# EAGLE schematic Arm Board V4 (EAGLE 7.1.0)

## Sheet 1 of 5: Power
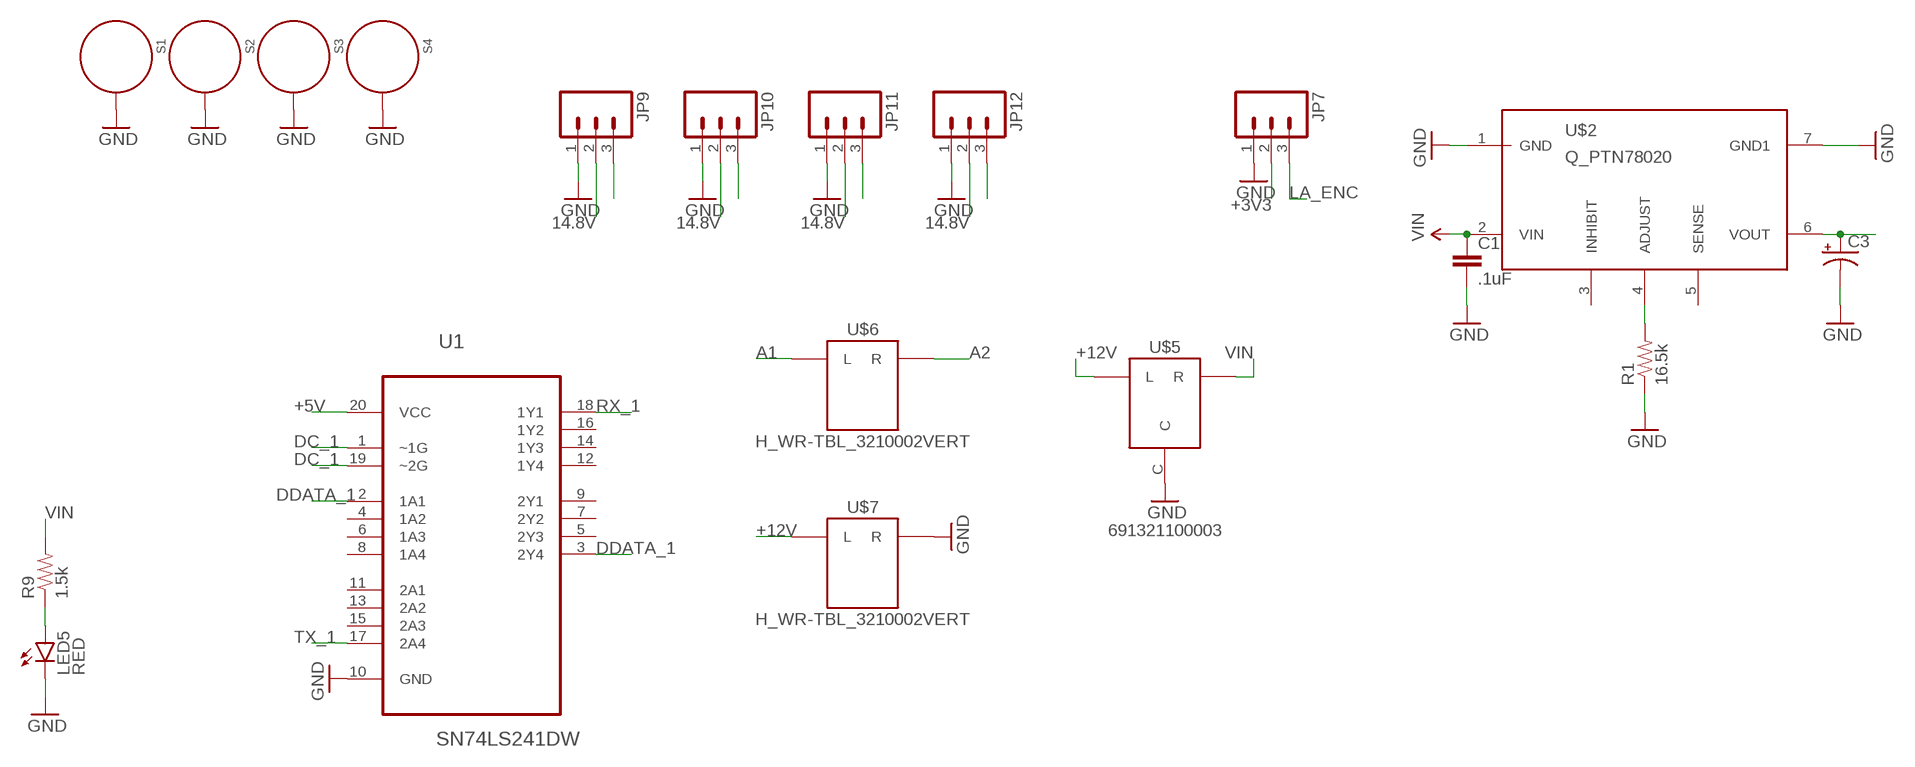
[diagram p0: schematic, sheet 1]

### Parts
C1  .1uF  CAP1206  [1206]
C3  CAP_POLC  [PANASONIC_C]
JP7  M03PTH  [1X03]
JP9  M03PTH  [1X03]
JP10  M03PTH  [1X03]
JP11  M03PTH  [1X03]
JP12  M03PTH  [1X03]
LED5  RED  LED-RED0603  [LED-0603]
R1  16.5k  RESISTOR1206  [1206]
R9  1.5k  RESISTOR1206  [1206]
S1  STANDOFF_ELECTRICAL  [STANDOFF-ELECTRICAL]
S2  STANDOFF_ELECTRICAL  [STANDOFF-ELECTRICAL]
S3  STANDOFF_ELECTRICAL  [STANDOFF-ELECTRICAL]
S4  STANDOFF_ELECTRICAL  [STANDOFF-ELECTRICAL]
U1  SN74LS241DW  [SOIC127P1030X265-20N]
U$2  Q_PTN78020  [R_PDSS-T7]
U$5  691321100003  [691322110003]
U$6  H_WR-TBL_3210002VERT  [691321100002]
U$7  H_WR-TBL_3210002VERT  [691321100002]

### Nets
14.8V: C3.+ JP9.2 JP10.2 JP11.2 JP12.2 U$2.6(VOUT)
+3V3: JP7.2 ; also sheet 2,3,4
+5V: U1.20(VCC) ; also sheet 2
+12V: U$5.L U$7.L ; also sheet 5
A1: U$6.L ; also sheet 5
A2: U$6.R ; also sheet 5
DC_1: U1.1(~1G) U1.19(~2G) ; also sheet 2
DDATA_1: JP9.3 JP10.3 JP11.3 JP12.3 U1.2(1A1) U1.3(2Y4)
GND: C1.2 C3.- JP7.1 JP9.1 JP10.1 JP11.1 JP12.1 LED5.C R1.1 S1.P1 S2.P1 S3.P1 S4.P1 U1.10(GND) U$2.1(GND) U$2.7(GND1) U$5.C U$7.R ; also sheet 2,3,4,5
LA_ENC: JP7.3 ; also sheet 2
N$9: R1.2 U$2.4(ADJUST)
N$14: LED5.A R9.1
RX_1: U1.18(1Y1) ; also sheet 2
TX_1: U1.17(2A4) ; also sheet 2
VIN: C1.1 R9.2 U$2.2(VIN) U$5.R
Unconnected: U1.4(1A2) U1.5(2Y3) U1.6(1A3) U1.7(2Y2) U1.8(1A4) U1.9(2Y1) U1.11(2A1) U1.12(1Y4) U1.13(2A2) U1.14(1Y3) U1.15(2A3) U1.16(1Y2) U$2.3(INHIBIT) U$2.5(SENSE)

## Sheet 2 of 5: Processor
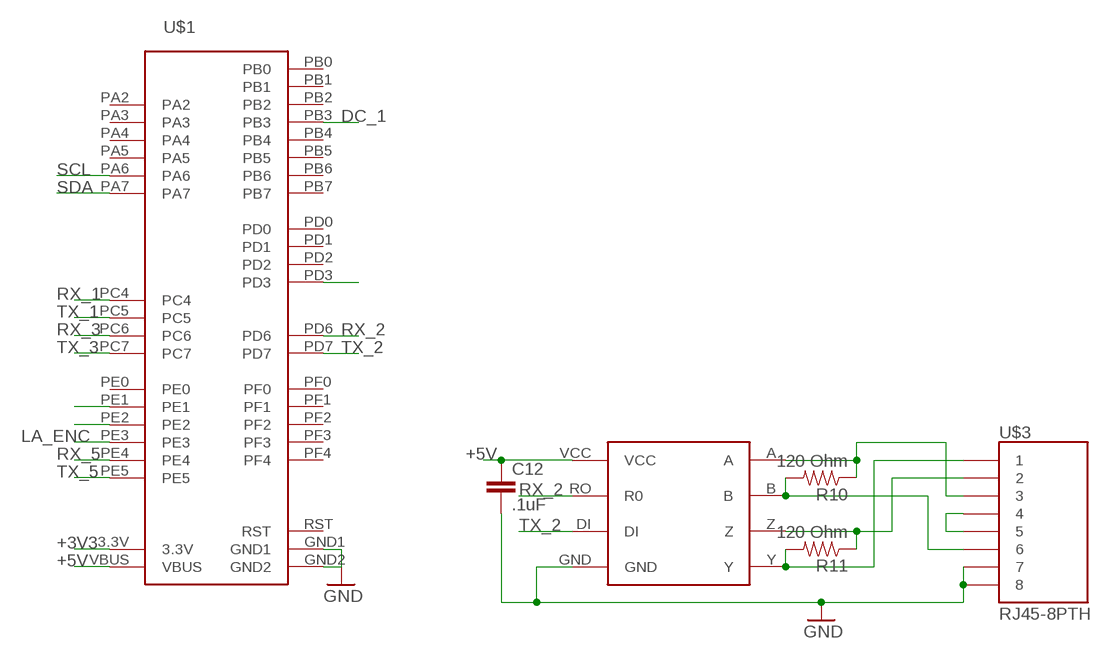
[diagram p1: schematic, sheet 2]

### Parts
C12  .1uF  CAP1206  [1206]
R10  120 Ohm  RESISTOR1206  [1206]
R11  120 Ohm  RESISTOR1206  [1206]
U$1  STELLARIS-LAUNCHPADSTELLARIS-LAUNCHPAD-XL  [LAUNCHPAD-XL]
U$3  RJ45-8PTH  [RJ45-8]
U$4  MAX3077  [MAX3070E]

### Nets
+3V3: U$1.3.3V ; also sheet 1,3,4
+5V: C12.1 U$1.VBUS U$3.4 U$3.5 U$4.VCC ; also sheet 1
DC_1: U$1.PB3 ; also sheet 1
EN_A: U$1.PD3 ; also sheet 5
GND: C12.2 U$1.GND1 U$1.GND2 U$3.7 U$3.8 U$4.GND ; also sheet 1,3,4,5
IN1_A: U$1.PE1 ; also sheet 5
IN2_A: U$1.PE2 ; also sheet 5
LA_ENC: U$1.PE3 ; also sheet 1
N$1: R11.1 U$3.2 U$4.Z
N$2: R10.2 U$3.6 U$4.B
N$3: R10.1 U$3.3 U$4.A
N$5: R11.2 U$3.1 U$4.Y
RX_1: U$1.PC4 ; also sheet 1
RX_2: U$1.PD6 U$4.RO(R0)
RX_3: U$1.PC6 ; also sheet 3
RX_5: U$1.PE4
SCL: U$1.PA6 ; also sheet 4
SDA: U$1.PA7 ; also sheet 4
TX_1: U$1.PC5 ; also sheet 1
TX_2: U$1.PD7 U$4.DI
TX_3: U$1.PC7 ; also sheet 3
TX_5: U$1.PE5
Unconnected: U$1.PA2 U$1.PA3 U$1.PA4 U$1.PA5 U$1.PB0 U$1.PB1 U$1.PB2 U$1.PB4 U$1.PB5 U$1.PB6 U$1.PB7 U$1.PD0 U$1.PD1 U$1.PD2 U$1.PE0 U$1.PF0 U$1.PF1 U$1.PF2 U$1.PF3 U$1.PF4

## Sheet 3 of 5: Xbee
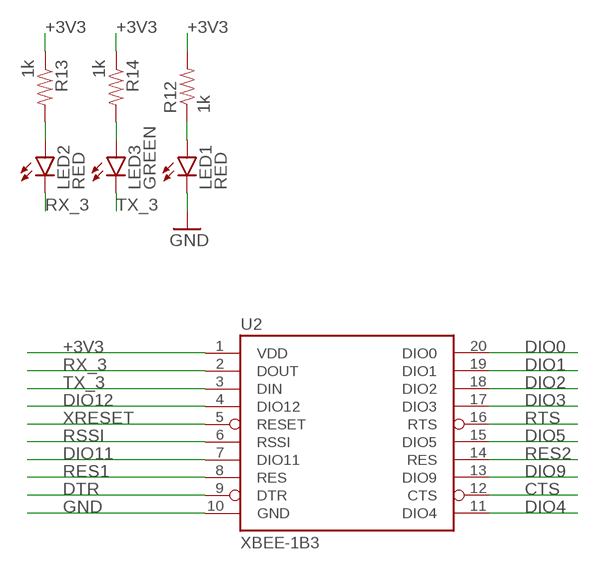
[diagram p2: schematic, sheet 3]

### Parts
LED1  RED  LED-RED0603  [LED-0603]
LED2  RED  LED-RED0603  [LED-0603]
LED3  GREEN  LED-GREEN0603  [LED-0603]
R12  1k  RESISTOR1206  [1206]
R13  1k  RESISTOR1206  [1206]
R14  1k  RESISTOR1206  [1206]
U2  XBEE-1B3  [XBEE-SMD]

### Nets
+3V3: R12.2 R13.1 R14.1 U2.1(VDD) ; also sheet 1,2,4
CTS: U2.12(CTS)
DIO0: U2.20(DIO0)
DIO1: U2.19(DIO1)
DIO2: U2.18(DIO2)
DIO3: U2.17(DIO3)
DIO4: U2.11(DIO4)
DIO5: U2.15(DIO5)
DIO9: U2.13(DIO9)
DIO11: U2.7(DIO11)
DIO12: U2.4(DIO12)
DTR: U2.9(DTR)
GND: LED1.C U2.10(GND) ; also sheet 1,2,4,5
N$4: LED2.A R13.2
N$6: LED3.A R14.2
N$38: LED1.A R12.1
RES1: U2.8(RES)
RES2: U2.14(RES)
RSSI: U2.6(RSSI)
RTS: U2.16(RTS)
RX_3: LED2.C U2.2(DOUT) ; also sheet 2
TX_3: LED3.C U2.3(DIN) ; also sheet 2
XRESET: U2.5(RESET)

## Sheet 4 of 5
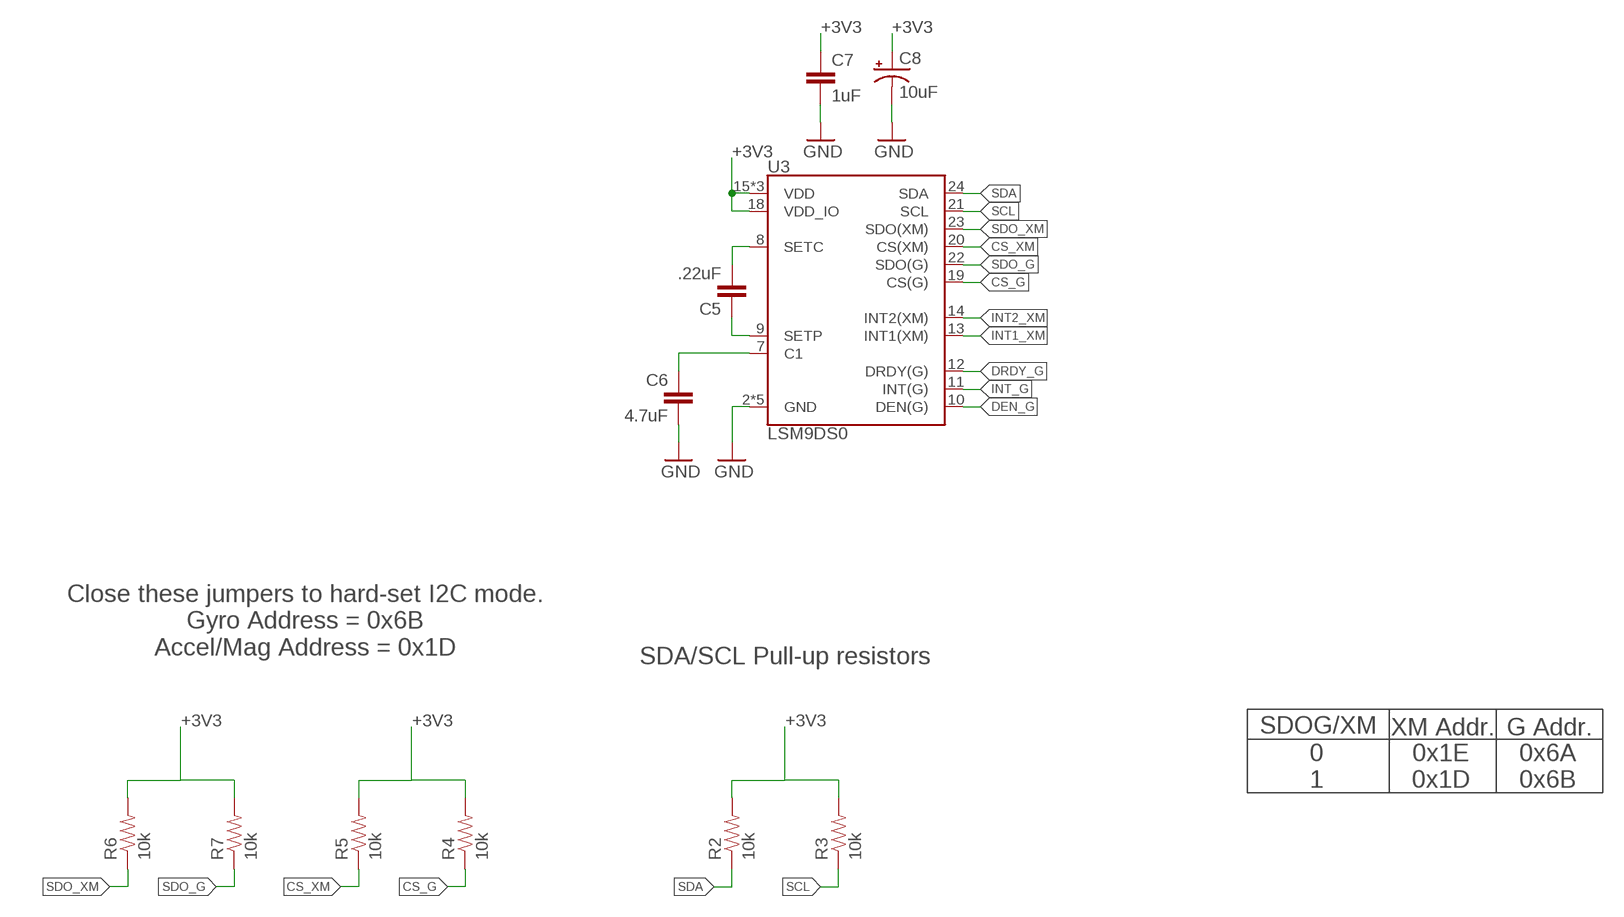
[diagram p3: schematic, sheet 4]

### Parts
C5  .22uF  CAP1206  [1206]
C6  4.7uF  CAP1206  [1206]
C7  1uF  CAP1206  [1206]
C8  10uF  10UF-16V-10%(TANT)  [EIA3216]
R2  10k  RESISTOR1206  [1206]
R3  10k  RESISTOR1206  [1206]
R4  10k  RESISTOR1206  [1206]
R5  10k  RESISTOR1206  [1206]
R6  10k  RESISTOR1206  [1206]
R7  10k  RESISTOR1206  [1206]
U3  LSM9DS0  [LGA-24]

### Nets
+3V3: C7.1 C8.A(+) R2.2 R3.2 R4.2 R5.2 R6.2 R7.2 U3.15(VDD) U3.16(VDD) U3.17(VDD) U3.18(VDD_IO) ; also sheet 1,2,3
CS_G: R4.1 U3.19(CS(G))
CS_XM: R5.1 U3.20(CS(XM))
DEN_G: U3.10(DEN(G))
DRDY_G: U3.12(DRDY(G))
GND: C6.2 C7.2 C8.C(-) U3.2(GND) U3.3(GND) U3.4(GND) U3.5(GND) U3.6(GND) ; also sheet 1,2,3,5
INT1_XM: U3.13(INT1(XM))
INT2_XM: U3.14(INT2(XM))
INT_G: U3.11(INT(G))
N$10: C5.1 U3.9(SETP)
N$11: C5.2 U3.8(SETC)
N$12: C6.1 U3.7(C1)
SCL: R3.1 U3.21(SCL) ; also sheet 2
SDA: R2.1 U3.24(SDA) ; also sheet 2
SDO_G: R7.1 U3.22(SDO(G))
SDO_XM: R6.1 U3.23(SDO(XM))

### Notes on the sheet
- Close these jumpers to hard-set I2C mode.
  Gyro Address = 0x6B
  Accel/Mag Address = 0x1D
- SDA/SCL Pull-up resistors
- SDOG/XM | XM Addr. | G Addr.
- 0
  1
- 0x1E
  0x1D
- 0x6A
  0x6B

## Sheet 5 of 5
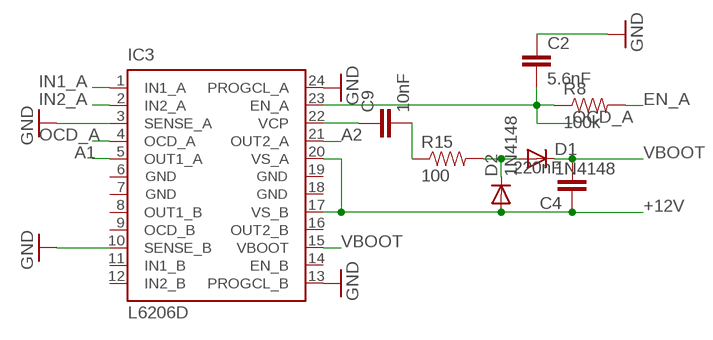
[diagram p4: schematic, sheet 5]

### Parts
C2  5.6nF  CAP1206  [1206]
C4  220nF  CAP1206  [1206]
C9  10nF  CAP1206  [1206]
D1  1N4148  DIODE1N4148  [DIODE-1N4148]
D2  1N4148  DIODE1N4148  [DIODE-1N4148]
IC3  L6206D  [SO24]
R8  100k  RESISTOR1206  [1206]
R15  100  RESISTOR1206  [1206]

### Nets
+12V: C4.1 D2.A IC3.17(VS_B) IC3.20(VS_A) ; also sheet 1
A1: IC3.5(OUT1_A) ; also sheet 1
A2: IC3.21(OUT2_A) ; also sheet 1
EN_A: R8.2 ; also sheet 2
GND: C2.1 IC3.3(SENSE_A) IC3.10(SENSE_B) IC3.13(PROGCL_B) IC3.24(PROGCL_A) ; also sheet 1,2,3,4
IN1_A: IC3.1(IN1_A) ; also sheet 2
IN2_A: IC3.2(IN2_A) ; also sheet 2
N$17: D1.A D2.C R15.2
N$18: C9.2 R15.1
N$19: C9.1 IC3.22(VCP)
OCD_A: C2.2 IC3.4(OCD_A) IC3.23(EN_A) R8.1
VBOOT: C4.2 D1.C IC3.15(VBOOT)
Unconnected: IC3.8(OUT1_B) IC3.9(OCD_B) IC3.11(IN1_B) IC3.12(IN2_B) IC3.14(EN_B) IC3.16(OUT2_B)

## Power pins joined to a net without a drawn wire
GND: IC3.6(GND) IC3.7(GND) IC3.18(GND) IC3.19(GND)
RST: U$1.RST

## Library data of the parts
C1 C5-C7 C12 = SparkFun-Capacitors:CAP: Capacitor Standard 0603 ceramic capacitor, and 0.1" leaded capacitor.
C2 C4 C9 = SparkFun-Passives:CAP: Capacitor Standard 0603 ceramic capacitor, and 0.1" leaded capacitor.
C3 = SparkFun-Passives:CAP_POL: Capacitor Polarized These are standard SMD and PTH capacitors. Normally 10uF, 47uF, and 100uF in electrolytic and tantalum varieties. Always verify the external diameter of the through hole cap, it varies with capacity, voltage, and manufacturer. The EIA devices should be standard.
C8 = SparkFun-Capacitors:10UF-16V-10%(TANT): CAP-00811 1206/EIA-3216 Tantalum capacitor; PROD_ID: CAP-00811
D1 D2 = SparkFun-DiscreteSemi:DIODE: Diode These are standard reverse protection diodes and small signal diodes. SMA package can handle up to about 1A. SOD-323 can handle about 200mA. What the SOD-323 package when ordering, there are some mfgs out there that are 5-pin packages.
IC3 = L6206D:L6206: DUAL DMOS FULL BRIDGE MOTOR DRIVER
JP7 JP9-JP12 = SparkFun-Connectors:M03: Header 3 Standard 3-pin 0.1" header. Use with straight break away headers (SKU : PRT-00116), right angle break away headers (PRT-00553), swiss pins (PRT-00743), machine pins (PRT-00117), and female headers (PRT-00115). Molex polarized connector foot print use with SKU : PRT-08232 with associated crimp pins and housings.
LED1 LED2 LED5 = SparkFun-LED:LED-RED: Assorted Red LEDs LilyPad 1206- DIO-09912 1206- DIO-00809 0603- DIO-00819; PROD_ID: DIO-00819
LED3 = SparkFun-LED:LED-GREEN: Various green LEDs Green LEDs used in SFE Production 0603- DIO-00821 LARGE- DIO-00862 LILYPAD- DIO-09910; PROD_ID: DIO-00821
R1 R9-R14 = SparkFun-Passives:RESISTOR: Resistor Basic schematic elements and footprints for 0603, 1206, and PTH resistors.
R2-R8 R15 = SparkFun-Resistors:RESISTOR: Resistor Basic schematic elements and footprints for 0603, 1206, and PTH resistors.
S1-S4 = SparkFun-Electromechanical:STANDOFF_ELECTRICAL: A standoff intended to be an electrically connected point. Pad size and stop size allow for a #4 Phillips pan screw head to make a solid connection to the board.
U1 = 74LS241:SN74LS241DW: OCTAL BUFFERS AND LINE DRIVERS WITH 3-STATE OUTPUTS; MPN: SN74LS241DW; OC_FARNELL: 1739687; OC_NEWARK: 50R6539; PACKAGE: SOIC-20; SUPPLIER: Texas Instruments
U2 = SparkFun:XBEE-1
U3 = SparkFun-DigitalIC:LSM9DS0: LSM9DS0 3D Accelerometer, 3D Gyroscope, 3D Magnetomter Features: 3 acceleration channels, 3 angular rate channels, 3 magnetic field channels ±2/±4/±6/±8/±16 g linear acceleration full scale ±2/±4/±8/±12 gauss magnetic full scale ±245/±500/±2000 dps angular rate full scale 16-bit data output SPI / I2C serial interfaces Analog supply voltage 2.4 V to 3.6 V Power-down mode / low-power mode Programmable interrupt generators Embedded self-test Embedded temperature sensor Embedded FIFO Position and motion detection functions Click/double-click recognition
U$1 = StellarisLaunchPad_Fred:STELLARIS-LAUNCHPAD
U$2 = MRDT-2014-All:Q_PTN78020: TI DC/DC converter 36Vin - Adjustable output
U$3 = SparkFun-Connectors:RJ45-8: RJ45 Jack Simple RJ45, 8-pin connection - connector for common Cat5, Cat5e, and Cat6 Ethernet cables. Footprint not yet proven in production. Connector sku is PRT-00643; Breakout PCB sku is BOB-00716.
U$4 = MAX3077:MAX3077
U$5 = MRDT-2015-PowerBoard:691321100003
U$6 U$7 = MRDT-2015-PowerBoard:H_WR-TBL_32*1*0002: Wurth Electronic's 2-pin 10A pluggable screw terminal headers. Vertical and Horizantal Part Numbers: 691322110002 (Horizantal) 691321100002 (Vertical); DIGIKEY_PN: 732-2763-ND

## Net classes
1 USB: drill 0.406 mm, clearance 0.203 mm to class 0, clearance 0.406 mm
3 usbvcc: width 0.61 mm, drill 0.508 mm, clearance 0.203 mm to class 0, clearance 0.254 mm